# Altium project iRat.PrjPcb
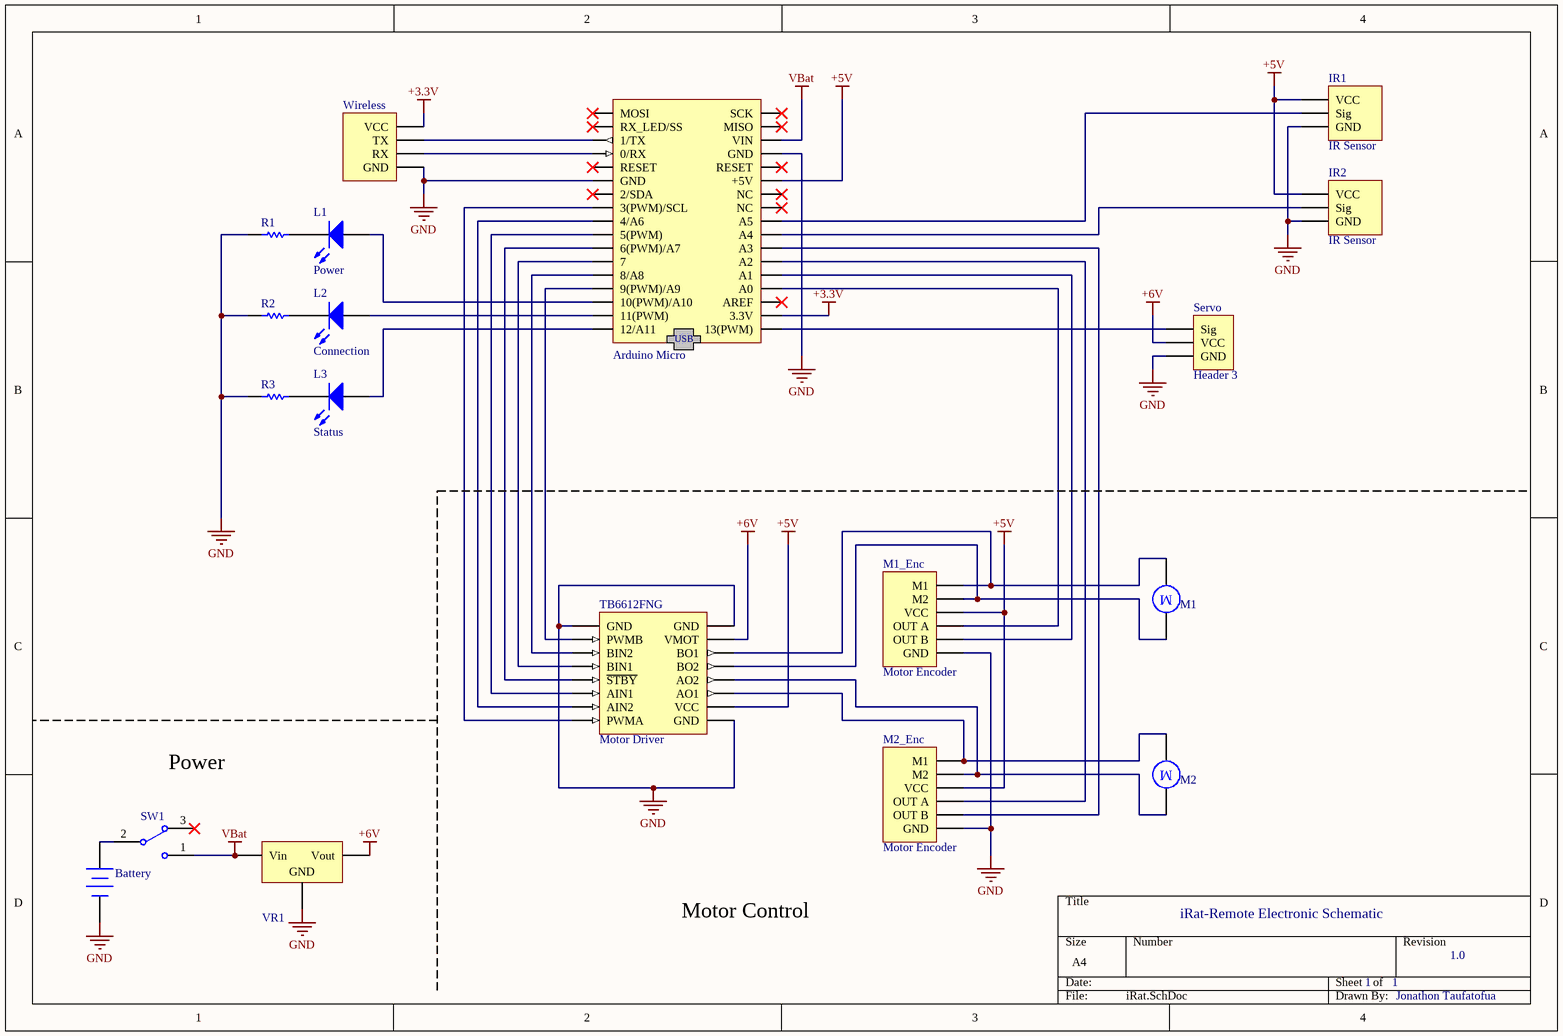
[diagram p0: iRat.SchDoc]
1 sheet, 19 parts. Net scope: global (net labels, ports and power ports of the same name join across sheets).

## Sheet iRat.SchDoc
size A4

### Parts
Arduino_Micro  Arduino Micro  (value not drawn)
Battery  Battery  [BAT-2]  (value not drawn)
IR1  IR Sensor
IR2  IR Sensor
L1  Power
L2  Connection
L3  Status
M1  M1  (value not drawn)
M1_Enc  Motor Encoder
M2  M1  (value not drawn)
M2_Enc  Motor Encoder
R1  Res1  [AXIAL-0.3]  (value not drawn)
R2  Res1  [AXIAL-0.3]  (value not drawn)
R3  Res1  [AXIAL-0.3]  (value not drawn)
Servo  Header 3  [HDR1X3]
SW1  SW-SPDT  [TL36WW15050]  (value not drawn)
TB6612FNG  Motor Driver
VR1  Volt Reg  (value not drawn)
Wireless  Wireless Module  (value not drawn)

### Nets
+3.3V: Arduino_Micro.3.3V Wireless.VCC
+5V: Arduino_Micro.+5V IR1.?1(VCC) IR2.?1(VCC) M1_Enc.VCC M2_Enc.VCC TB6612FNG.VCC
+6V: Servo.2(VCC) TB6612FNG.VMOT VR1.3(Vout)
GND: Arduino_Micro.GND Battery.2(-) IR1.?2(GND) IR2.?2(GND) M1_Enc.GND M2_Enc.GND R1.1 R2.1 R3.1 Servo.3(GND) TB6612FNG.GND VR1.2(GND) Wireless.GND
VBat: Arduino_Micro.VIN SW1.1 VR1.1(Vin)
NetArduino_Micro_0/RX: Arduino_Micro.0/RX Wireless.RX
NetArduino_Micro_1/TX: Arduino_Micro.1/TX Wireless.TX
NetArduino_Micro_3(PWM)/SCL: Arduino_Micro.3(PWM)/SCL TB6612FNG.PWMA
NetArduino_Micro_4/A6: Arduino_Micro.4/A6 TB6612FNG.AIN2
NetArduino_Micro_5(PWM): Arduino_Micro.5(PWM) TB6612FNG.AIN1
NetArduino_Micro_6(PWM)/A7: Arduino_Micro.6(PWM)/A7 TB6612FNG.\STBY(~{STBY})
NetArduino_Micro_7: Arduino_Micro.7 TB6612FNG.BIN1
NetArduino_Micro_8/A8: Arduino_Micro.8/A8 TB6612FNG.BIN2
NetArduino_Micro_9(PWM)/A9: Arduino_Micro.9(PWM)/A9 TB6612FNG.PWMB
NetArduino_Micro_10(PWM)/A10: Arduino_Micro.10(PWM)/A10 L1.1(A)
NetArduino_Micro_11(PWM): Arduino_Micro.11(PWM) L2.1(A)
NetArduino_Micro_12/A11: Arduino_Micro.12/A11 L3.1(A)
NetArduino_Micro_13(PWM): Arduino_Micro.13(PWM) Servo.1(Sig)
NetArduino_Micro_A0: Arduino_Micro.A0 M1_Enc.OUT_A
NetArduino_Micro_A1: Arduino_Micro.A1 M1_Enc.OUT_B
NetArduino_Micro_A2: Arduino_Micro.A2 M2_Enc.OUT_A
NetArduino_Micro_A3: Arduino_Micro.A3 M2_Enc.OUT_B
NetArduino_Micro_A4: Arduino_Micro.A4 IR2.?3(Sig)
NetArduino_Micro_A5: Arduino_Micro.A5 IR1.?3(Sig)
NetBattery_1: Battery.1(+) SW1.2
NetL1_2: L1.2(K) R1.2
NetL2_2: L2.2(K) R2.2
NetL3_2: L3.2(K) R3.2
NetM1_1: M1.1 M1_Enc.M2 TB6612FNG.BO2
NetM1_2: M1.2 M1_Enc.M1 TB6612FNG.BO1
NetM2_1: M2.1 M2_Enc.M2 TB6612FNG.AO2
NetM2_2: M2.2 M2_Enc.M1 TB6612FNG.AO1

Not connected (* = marked no-connect by the designer): Arduino_Micro 2/SDA* AREF* MISO* MOSI* NC* RESET* RX_LED/SS* SCK*; SW1 3*

### Notes on the sheet
- Power
- Motor Control
- iRat-Remote Electronic Schematic
- 1
- 1.0
- Jonathon Taufatofua
- (in symbol Arduino Micro) USB
- (in symbol Motor) M

### Library data of the parts
Battery = Battery: Multicell Battery; Published: 24-Mar-1999; LatestRevisionDate: 17-Jul-2002; LatestRevisionNote: Re-released for DXP Platform.; PackageReference: BAT-2; Publisher: Altium Limited; PackageDescription: Battery; 2 Leads
L1-L3 = LED0: Typical INFRARED GaAs LED; PackageDescription: LED; 2 Leads
  L2 L3: Published: 8-Jun-2000; LatestRevisionDate: 08-Jul-2005; LatestRevisionNote: Mech Layer 1 removed.; PackageReference: LED-0; Publisher: Altium Limited
M1 M2 = Motor: Motor, General Kind; Published: 24-Mar-1999; LatestRevisionDate: 17-Jul-2002; LatestRevisionNote: Re-released for DXP Platform.; PackageReference: RB5-10.5; Publisher: Altium Limited; PackageDescription: Capacitor (Radial); 2 Leads
R1-R3 = Res1: Resistor; Value: 1K; Published: 8-Jun-2000; LatestRevisionDate: 17-Jul-2002; LatestRevisionNote: Re-released for DXP Platform.; PackageReference: AXIAL-0.3; Publisher: Altium Limited; PackageDescription: Axial Device, Thru-Hole; 2 Leads; 0.3 in Pin Spacing
Servo = Header 3: Header, 3-Pin; LatestRevisionDate: 17-Jul-2002; LatestRevisionNote: Re-released for DXP Platform.; Publisher: Altium Limited
SW1 = SW-SPDT: SPDT Subminiature Toggle Switch, Right Angle Mounting, Vertical Actuation; Published: 24-Mar-1999; LatestRevisionDate: 17-Dec-2003; LatestRevisionNote: Schematic revised, PCB Footprint replaced.; DatasheetVersion: 05-Dec-2000; PackageReference: TL36WW15050; Publisher: Altium Limited; PackageDescription: Switch; 4 Leads; ComponentLink1Description: Manufacturer Link; ComponentLink1URL: http://www.apem.com
TB6612FNG = TB6612FNG Motor Driver
VR1 = Volt Reg: Voltage Regulator; Published: 24-Mar-1999; LatestRevisionDate: 29-May-2009; LatestRevisionNote: IPC-7351 Footprint Added.; PackageReference: D2PAK; Publisher: Altium Limited; PackageDescription: 3-Pin Transistor Outline Package 2.54 mm Pitch, 15.1 mm Lead Span